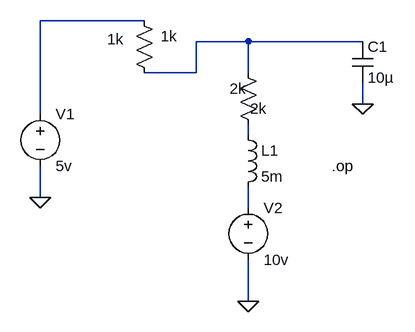
[diagram p0: schematic task1.asc]
task1.asc, the LTspice schematic file:
Version 4
SHEET 1 880 680
WIRE 144 208 -16 208
WIRE 304 240 224 240
WIRE 480 240 304 240
WIRE 224 288 224 240
WIRE 224 288 144 288
WIRE 304 288 304 240
WIRE 480 336 480 304
WIRE -16 352 -16 208
WIRE 304 384 304 368
WIRE -16 480 -16 432
WIRE 304 496 304 464
WIRE 304 640 304 576
FLAG 480 336 0
FLAG 304 640 0
FLAG -16 480 0
SYMBOL Res 128 192 R0
WINDOW 0 -28 60 Bottom 2
WINDOW 3 54 24 Top 2
SYMATTR InstName 1k
SYMATTR Value 1k
SYMBOL Res 288 272 R0
WINDOW 0 0 56 Bottom 2
WINDOW 3 32 56 Top 2
SYMATTR InstName 2k
SYMATTR Value 2k
SYMBOL ind 288 368 R0
SYMATTR InstName L1
SYMATTR Value 5m
SYMBOL Cap 464 240 R0
SYMATTR InstName C1
SYMATTR Value 10µ
SYMBOL Voltage -16 336 R0
SYMATTR InstName V1
SYMATTR Value 5v
SYMBOL Voltage 304 480 R0
SYMATTR InstName V2
SYMATTR Value 10v
TEXT 432 432 Left 2 !.op

The netlist it stands for:
* task1.asc
R§1k N001 N002 1k
R§2k N002 N003 2k
L1 N003 N004 5m
C1 N002 0 10µ
V1 N001 0 5v
V2 N004 0 10v
.op
.backanno
.end